# Altium schematic sheet FPGA_Banks_47_48_HP.SchDoc: =ProjectName
size 420 x 297 mm; Author: T.P.; CompanyName: WUT; DrawnBy: T.P.; Organization: WUT ISE; Address1: Warsaw Univeristy of Technology; Address2: Nowowiejska 15/19; DocumentNumber: 6; Revision: 0.9; SheetNumber: 6; SheetTotal: 36; EDA_Number: ARTIQ; Projet: ARTIQ/SINARA; ModifiedBy: -; CreateDate: XX/XX/XXXX; CheckedDate: -; Title2: FPGA_Banks_47_48_HP.SchDoc; DivGrp: ISE; Designer: G.K. and T.P.; ModifiedDate: -; ProjectName: ADC/DAC MEZZANINE
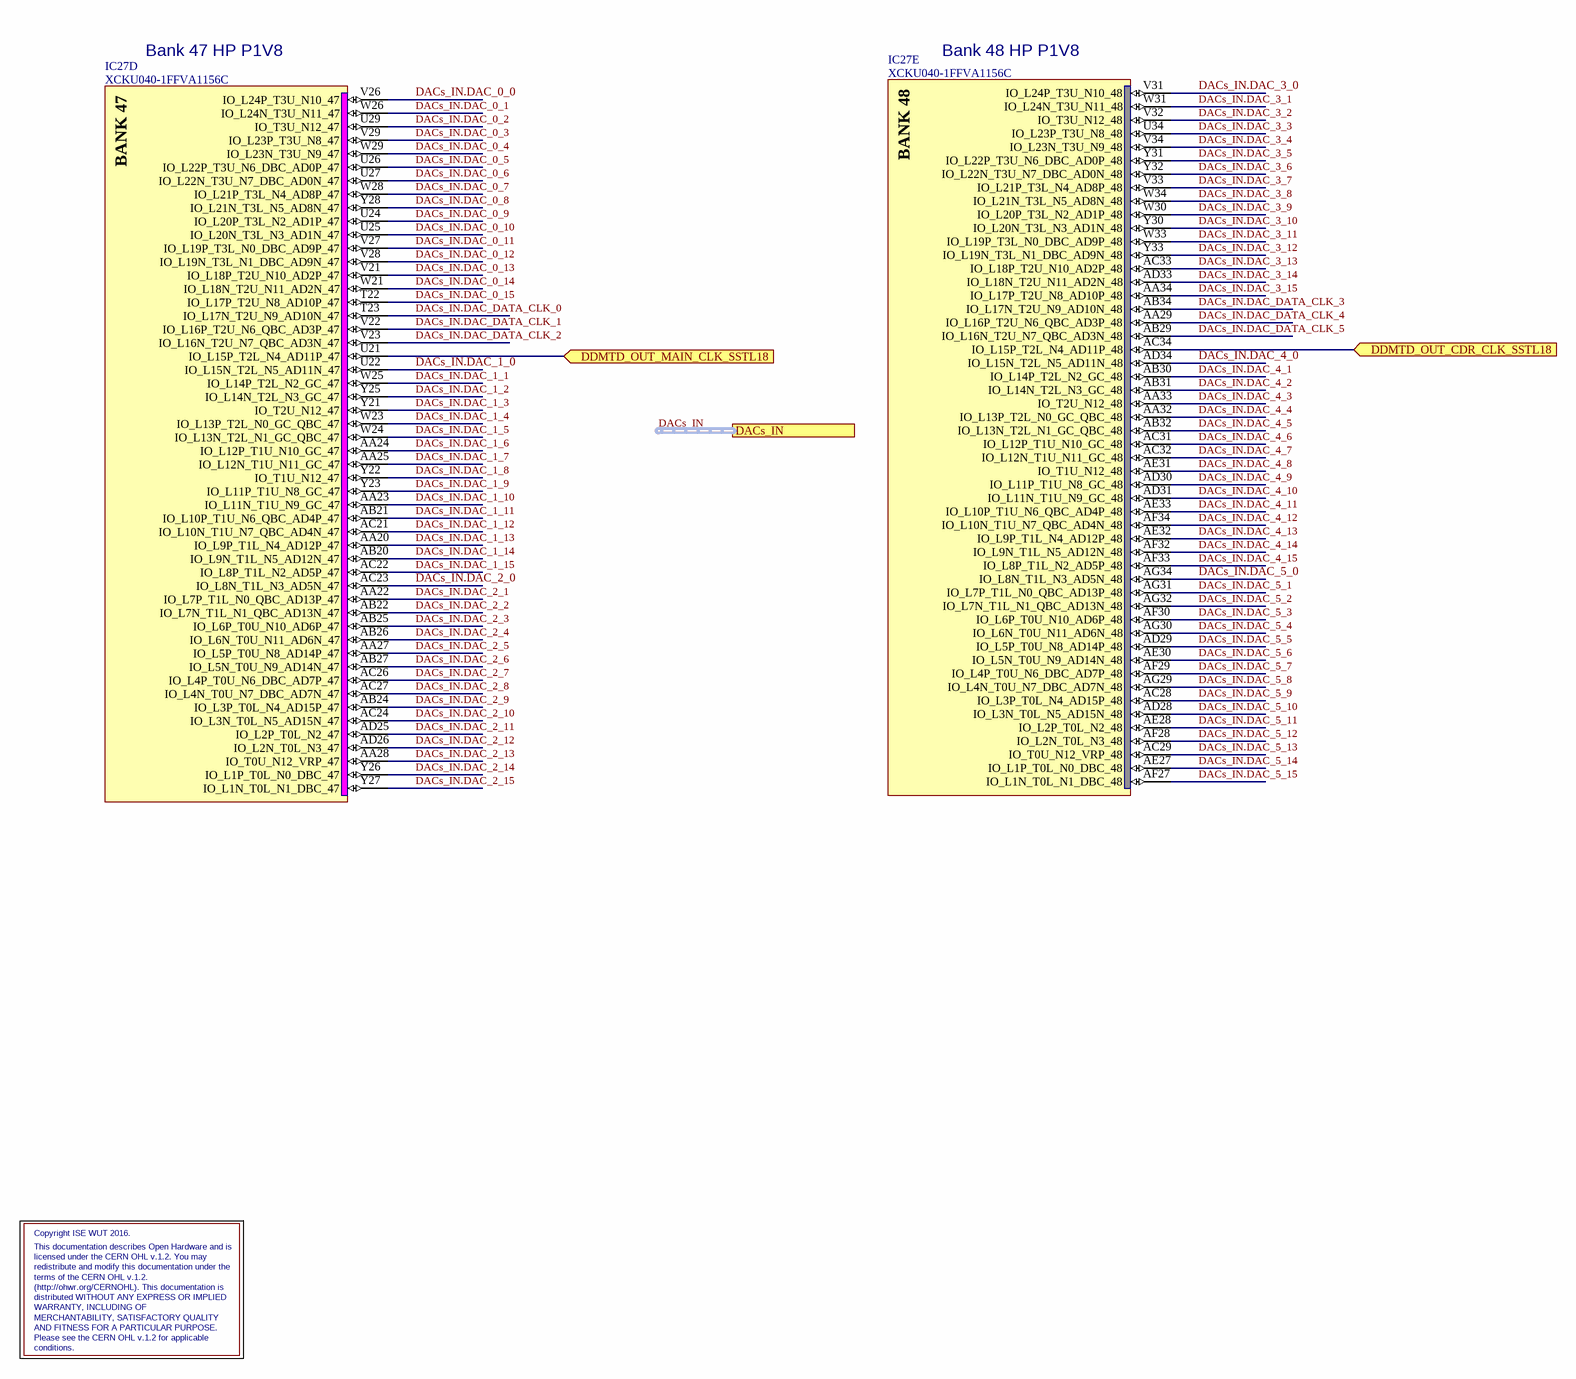
[diagram p0: FPGA_Banks_47_48_HP.SchDoc]

## Parts
IC27  XCKU040-1FFVA1156C  [BGA1156C100P34X34_3500X3500X350]  (parts D,E of 22)

## Ports
DACs_IN (harness DAC_IN), DDMTD_OUT_CDR_CLK_SSTL18 (in), DDMTD_OUT_MAIN_CLK_SSTL18 (in)

## Nets
DACs_IN.DAC_0_0: IC27.V26(IO_L24P_T3U_N10_47)
DACs_IN.DAC_0_1: IC27.W26(IO_L24N_T3U_N11_47)
DACs_IN.DAC_0_2: IC27.U29(IO_T3U_N12_47)
DACs_IN.DAC_0_3: IC27.V29(IO_L23P_T3U_N8_47)
DACs_IN.DAC_0_4: IC27.W29(IO_L23N_T3U_N9_47)
DACs_IN.DAC_0_5: IC27.U26(IO_L22P_T3U_N6_DBC_AD0P_47)
DACs_IN.DAC_0_6: IC27.U27(IO_L22N_T3U_N7_DBC_AD0N_47)
DACs_IN.DAC_0_7: IC27.W28(IO_L21P_T3L_N4_AD8P_47)
DACs_IN.DAC_0_8: IC27.Y28(IO_L21N_T3L_N5_AD8N_47)
DACs_IN.DAC_0_9: IC27.U24(IO_L20P_T3L_N2_AD1P_47)
DACs_IN.DAC_0_10: IC27.U25(IO_L20N_T3L_N3_AD1N_47)
DACs_IN.DAC_0_11: IC27.V27(IO_L19P_T3L_N0_DBC_AD9P_47)
DACs_IN.DAC_0_12: IC27.V28(IO_L19N_T3L_N1_DBC_AD9N_47)
DACs_IN.DAC_0_13: IC27.V21(IO_L18P_T2U_N10_AD2P_47)
DACs_IN.DAC_0_14: IC27.W21(IO_L18N_T2U_N11_AD2N_47)
DACs_IN.DAC_0_15: IC27.T22(IO_L17P_T2U_N8_AD10P_47)
DACs_IN.DAC_1_0: IC27.U22(IO_L15N_T2L_N5_AD11N_47)
DACs_IN.DAC_1_1: IC27.W25(IO_L14P_T2L_N2_GC_47)
DACs_IN.DAC_1_2: IC27.Y25(IO_L14N_T2L_N3_GC_47)
DACs_IN.DAC_1_3: IC27.Y21(IO_T2U_N12_47)
DACs_IN.DAC_1_4: IC27.W23(IO_L13P_T2L_N0_GC_QBC_47)
DACs_IN.DAC_1_5: IC27.W24(IO_L13N_T2L_N1_GC_QBC_47)
DACs_IN.DAC_1_6: IC27.AA24(IO_L12P_T1U_N10_GC_47)
DACs_IN.DAC_1_7: IC27.AA25(IO_L12N_T1U_N11_GC_47)
DACs_IN.DAC_1_8: IC27.Y22(IO_T1U_N12_47)
DACs_IN.DAC_1_9: IC27.Y23(IO_L11P_T1U_N8_GC_47)
DACs_IN.DAC_1_10: IC27.AA23(IO_L11N_T1U_N9_GC_47)
DACs_IN.DAC_1_11: IC27.AB21(IO_L10P_T1U_N6_QBC_AD4P_47)
DACs_IN.DAC_1_12: IC27.AC21(IO_L10N_T1U_N7_QBC_AD4N_47)
DACs_IN.DAC_1_13: IC27.AA20(IO_L9P_T1L_N4_AD12P_47)
DACs_IN.DAC_1_14: IC27.AB20(IO_L9N_T1L_N5_AD12N_47)
DACs_IN.DAC_1_15: IC27.AC22(IO_L8P_T1L_N2_AD5P_47)
DACs_IN.DAC_2_0: IC27.AC23(IO_L8N_T1L_N3_AD5N_47)
DACs_IN.DAC_2_1: IC27.AA22(IO_L7P_T1L_N0_QBC_AD13P_47)
DACs_IN.DAC_2_2: IC27.AB22(IO_L7N_T1L_N1_QBC_AD13N_47)
DACs_IN.DAC_2_3: IC27.AB25(IO_L6P_T0U_N10_AD6P_47)
DACs_IN.DAC_2_4: IC27.AB26(IO_L6N_T0U_N11_AD6N_47)
DACs_IN.DAC_2_5: IC27.AA27(IO_L5P_T0U_N8_AD14P_47)
DACs_IN.DAC_2_6: IC27.AB27(IO_L5N_T0U_N9_AD14N_47)
DACs_IN.DAC_2_7: IC27.AC26(IO_L4P_T0U_N6_DBC_AD7P_47)
DACs_IN.DAC_2_8: IC27.AC27(IO_L4N_T0U_N7_DBC_AD7N_47)
DACs_IN.DAC_2_9: IC27.AB24(IO_L3P_T0L_N4_AD15P_47)
DACs_IN.DAC_2_10: IC27.AC24(IO_L3N_T0L_N5_AD15N_47)
DACs_IN.DAC_2_11: IC27.AD25(IO_L2P_T0L_N2_47)
DACs_IN.DAC_2_12: IC27.AD26(IO_L2N_T0L_N3_47)
DACs_IN.DAC_2_13: IC27.AA28(IO_T0U_N12_VRP_47)
DACs_IN.DAC_2_14: IC27.Y26(IO_L1P_T0L_N0_DBC_47)
DACs_IN.DAC_2_15: IC27.Y27(IO_L1N_T0L_N1_DBC_47)
DACs_IN.DAC_3_0: IC27.V31(IO_L24P_T3U_N10_48)
DACs_IN.DAC_3_1: IC27.W31(IO_L24N_T3U_N11_48)
DACs_IN.DAC_3_2: IC27.V32(IO_T3U_N12_48)
DACs_IN.DAC_3_3: IC27.U34(IO_L23P_T3U_N8_48)
DACs_IN.DAC_3_4: IC27.V34(IO_L23N_T3U_N9_48)
DACs_IN.DAC_3_5: IC27.Y31(IO_L22P_T3U_N6_DBC_AD0P_48)
DACs_IN.DAC_3_6: IC27.Y32(IO_L22N_T3U_N7_DBC_AD0N_48)
DACs_IN.DAC_3_7: IC27.V33(IO_L21P_T3L_N4_AD8P_48)
DACs_IN.DAC_3_8: IC27.W34(IO_L21N_T3L_N5_AD8N_48)
DACs_IN.DAC_3_9: IC27.W30(IO_L20P_T3L_N2_AD1P_48)
DACs_IN.DAC_3_10: IC27.Y30(IO_L20N_T3L_N3_AD1N_48)
DACs_IN.DAC_3_11: IC27.W33(IO_L19P_T3L_N0_DBC_AD9P_48)
DACs_IN.DAC_3_12: IC27.Y33(IO_L19N_T3L_N1_DBC_AD9N_48)
DACs_IN.DAC_3_13: IC27.AC33(IO_L18P_T2U_N10_AD2P_48)
DACs_IN.DAC_3_14: IC27.AD33(IO_L18N_T2U_N11_AD2N_48)
DACs_IN.DAC_3_15: IC27.AA34(IO_L17P_T2U_N8_AD10P_48)
DACs_IN.DAC_4_0: IC27.AD34(IO_L15N_T2L_N5_AD11N_48)
DACs_IN.DAC_4_1: IC27.AB30(IO_L14P_T2L_N2_GC_48)
DACs_IN.DAC_4_2: IC27.AB31(IO_L14N_T2L_N3_GC_48)
DACs_IN.DAC_4_3: IC27.AA33(IO_T2U_N12_48)
DACs_IN.DAC_4_4: IC27.AA32(IO_L13P_T2L_N0_GC_QBC_48)
DACs_IN.DAC_4_5: IC27.AB32(IO_L13N_T2L_N1_GC_QBC_48)
DACs_IN.DAC_4_6: IC27.AC31(IO_L12P_T1U_N10_GC_48)
DACs_IN.DAC_4_7: IC27.AC32(IO_L12N_T1U_N11_GC_48)
DACs_IN.DAC_4_8: IC27.AE31(IO_T1U_N12_48)
DACs_IN.DAC_4_9: IC27.AD30(IO_L11P_T1U_N8_GC_48)
DACs_IN.DAC_4_10: IC27.AD31(IO_L11N_T1U_N9_GC_48)
DACs_IN.DAC_4_11: IC27.AE33(IO_L10P_T1U_N6_QBC_AD4P_48)
DACs_IN.DAC_4_12: IC27.AF34(IO_L10N_T1U_N7_QBC_AD4N_48)
DACs_IN.DAC_4_13: IC27.AE32(IO_L9P_T1L_N4_AD12P_48)
DACs_IN.DAC_4_14: IC27.AF32(IO_L9N_T1L_N5_AD12N_48)
DACs_IN.DAC_4_15: IC27.AF33(IO_L8P_T1L_N2_AD5P_48)
DACs_IN.DAC_5_0: IC27.AG34(IO_L8N_T1L_N3_AD5N_48)
DACs_IN.DAC_5_1: IC27.AG31(IO_L7P_T1L_N0_QBC_AD13P_48)
DACs_IN.DAC_5_2: IC27.AG32(IO_L7N_T1L_N1_QBC_AD13N_48)
DACs_IN.DAC_5_3: IC27.AF30(IO_L6P_T0U_N10_AD6P_48)
DACs_IN.DAC_5_4: IC27.AG30(IO_L6N_T0U_N11_AD6N_48)
DACs_IN.DAC_5_5: IC27.AD29(IO_L5P_T0U_N8_AD14P_48)
DACs_IN.DAC_5_6: IC27.AE30(IO_L5N_T0U_N9_AD14N_48)
DACs_IN.DAC_5_7: IC27.AF29(IO_L4P_T0U_N6_DBC_AD7P_48)
DACs_IN.DAC_5_8: IC27.AG29(IO_L4N_T0U_N7_DBC_AD7N_48)
DACs_IN.DAC_5_9: IC27.AC28(IO_L3P_T0L_N4_AD15P_48)
DACs_IN.DAC_5_10: IC27.AD28(IO_L3N_T0L_N5_AD15N_48)
DACs_IN.DAC_5_11: IC27.AE28(IO_L2P_T0L_N2_48)
DACs_IN.DAC_5_12: IC27.AF28(IO_L2N_T0L_N3_48)
DACs_IN.DAC_5_13: IC27.AC29(IO_T0U_N12_VRP_48)
DACs_IN.DAC_5_14: IC27.AE27(IO_L1P_T0L_N0_DBC_48)
DACs_IN.DAC_5_15: IC27.AF27(IO_L1N_T0L_N1_DBC_48)
DACs_IN.DAC_DATA_CLK_0: IC27.T23(IO_L17N_T2U_N9_AD10N_47)
DACs_IN.DAC_DATA_CLK_1: IC27.V22(IO_L16P_T2U_N6_QBC_AD3P_47)
DACs_IN.DAC_DATA_CLK_2: IC27.V23(IO_L16N_T2U_N7_QBC_AD3N_47)
DACs_IN.DAC_DATA_CLK_3: IC27.AB34(IO_L17N_T2U_N9_AD10N_48)
DACs_IN.DAC_DATA_CLK_4: IC27.AA29(IO_L16P_T2U_N6_QBC_AD3P_48)
DACs_IN.DAC_DATA_CLK_5: IC27.AB29(IO_L16N_T2U_N7_QBC_AD3N_48)
DDMTD_OUT_CDR_CLK_SSTL18: IC27.AC34(IO_L15P_T2L_N4_AD11P_48) ; port DDMTD_OUT_CDR_CLK_SSTL18
DDMTD_OUT_MAIN_CLK_SSTL18: IC27.U21(IO_L15P_T2L_N4_AD11P_47) ; port DDMTD_OUT_MAIN_CLK_SSTL18

## Buses and harness runs
harness DACs_IN = port DACs_IN

## Notes on the sheet
- Bank 47 HP P1V8
- Bank 48 HP P1V8
- Copyright ISE WUT 2016.
- distributed WITHOUT ANY EXPRESS OR IMPLIED
- redistribute and modify this documentation under the
- terms of the CERN OHL v.1.2.
- licensed under the CERN OHL v.1.2. You may
- WARRANTY, INCLUDING OF
- (http://ohwr.org/CERNOHL). This documentation is
- This documentation describes Open Hardware and is
- AND FITNESS FOR A PARTICULAR PURPOSE.
- conditions.
- Please see the CERN OHL v.1.2 for applicable
- MERCHANTABILITY, SATISFACTORY QUALITY
- Project/Equipment
- Document
- Designer
- Drawn by
- Check.by
- File
- Last Mod.
- Print Date
- Sheet
- Size
- A3
- of
- Rev
- (in symbol XCKU040-1FFVA1156C, part D) BANK 47
- (in symbol XCKU040-1FFVA1156C, part E) BANK 48

## Library data of the parts
IC27 = XCKU040-1FFVA1156C: Kintex UltraScale FPGA, 520 I/O, 530K Cells, 1156-Ball BGA, Speed Grade 1, Commercial Grade; Manufacturer: XILINX; Part Description: Kintex UltraScale, 40 DLL I/O, 416 HP I/O, 104 HR I/O, 1156-Pin BGA, Speed Grade 1, Commercial Grade; PressFit: No; Bonding: No; Manufacturer Part Number: XCKU040-1FFVA1156C; PackageDescription: BGA, 1.00mm Pitch, Square; 1156 Pin, 34 Columns X 34 Rows, Body 35.00mm X 35.00mm X 3.50mm H, IPC Medium Density; Part Number: XCKU040-1FFVA1156C; Component Kind: Standard; Component Type: Standard; Device: XCKU040-1FFVA1156C; Pin Count: 1156; Case: BGA1156; Mounted: Yes; Socket: No; SMD: Yes; Sense: No; ComponentHeight: 3.5mm; HelpURL: \\cern.ch\dfs\Applications\Altium\Datasheets\XCKU040-1FFVA1156C.pdf; ComponentLink1URL: \\cern.ch\dfs\Applications\Altium\Datasheets\XCKU040-1FFVA1156C_Package-Pinout.pdf; ComponentLink1Description: Package/Pinout; Author: CERN DEM CA; CreateDate: 16.08.2016; LatestRevisionDate: 16.08.2016